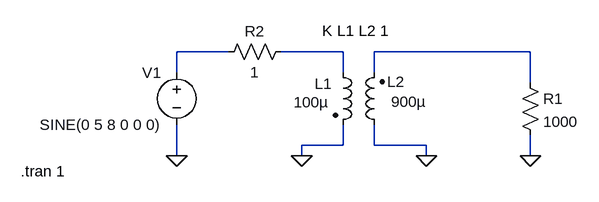
[diagram p0: schematic 06 Transformers.asc]
06 Transformers.asc, the LTspice schematic file:
Version 4
SHEET 1 880 680
WIRE 160 96 80 96
WIRE 336 96 240 96
WIRE 624 96 384 96
WIRE 80 128 80 96
WIRE 336 128 336 96
WIRE 384 128 384 96
WIRE 624 144 624 96
WIRE 336 240 336 208
WIRE 336 240 272 240
WIRE 384 240 384 208
WIRE 464 240 384 240
WIRE 80 256 80 208
WIRE 272 256 272 240
WIRE 464 256 464 240
WIRE 624 256 624 224
FLAG 272 256 0
FLAG 80 256 0
FLAG 464 256 0
FLAG 624 256 0
SYMBOL voltage 80 112 M0
WINDOW 123 0 0 Left 0
WINDOW 39 0 0 Left 0
SYMATTR InstName V1
SYMATTR Value SINE(0 5 8 0 0 0)
SYMBOL ind2 320 112 R0
WINDOW 0 -28 33 Left 2
WINDOW 3 -60 62 Left 2
SYMATTR InstName L1
SYMATTR Value 100µ
SYMATTR Type ind
SYMBOL ind2 400 224 R180
WINDOW 0 -31 82 Left 2
WINDOW 3 -64 51 Left 2
SYMATTR InstName L2
SYMATTR Value 900µ
SYMATTR Type ind
SYMBOL res 608 128 R0
SYMATTR InstName R1
SYMATTR Value 1000
SYMBOL res 256 80 R90
WINDOW 0 0 56 VBottom 2
WINDOW 3 32 56 VTop 2
SYMATTR InstName R2
SYMATTR Value 1
TEXT -160 280 Left 2 !.tran 1
TEXT 304 64 Left 2 !K L1 L2 1

The netlist it stands for:
* 06 Transformers.asc
V1 N001 0 SINE(0 5 8 0 0 0)
L1 N002 0 100µ
L2 0 N003 900µ
R1 N003 0 1000
R2 N002 N001 1
.tran 1
K L1 L2 1
.backanno
.end